# Altium schematic sheet Sheet2.SchDoc: Alarm_audio
size A; Date: 6/5/2021; Author: suren; DrawnBy: suren; DocumentNumber: 5; Time: 11.01PM
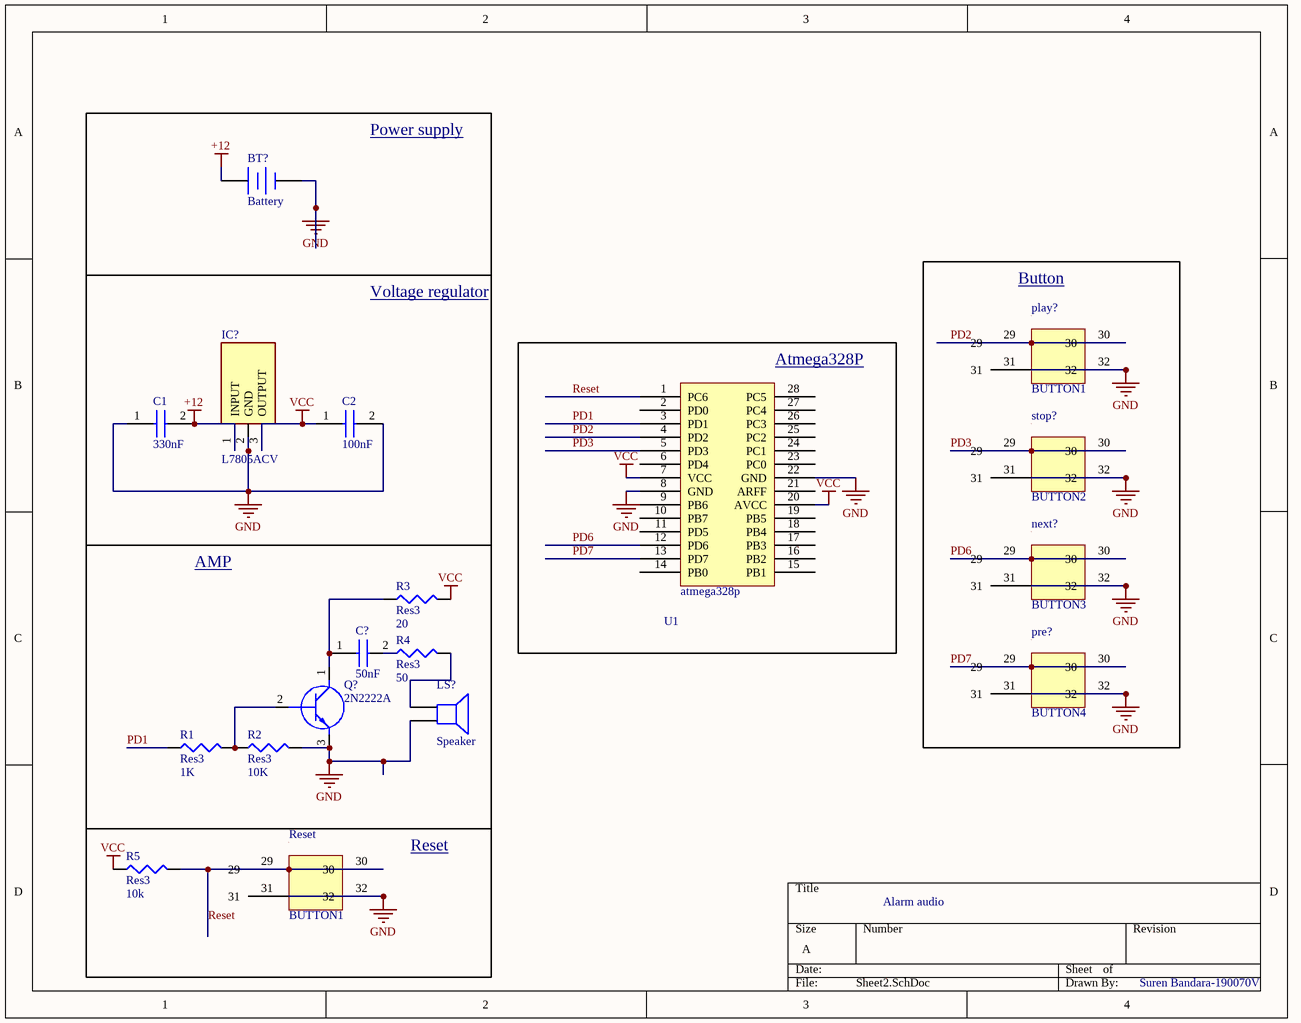
[diagram p0: Sheet2.SchDoc]

## Parts
BT?  Battery  [BAT-2]
C1  Capacitance: 330nF  [B32520C3104K000]  (hidden comment: B32520C3104K000)
C2  Capacirance: 100nF  [B32520C3104K000]  (hidden comment: B32520C3104K000)
C?  Capacirance: 50nF  [B32520C3104K000]  (hidden comment: B32520C3104K000)
IC?  L7805ACV  [TO255P460X1020X2008-3P]
LS?  Speaker  [PIN2]
next?  BUTTON3  [PCBComponent_6]
play?  BUTTON1  [PCBComponent_6]
pre?  BUTTON4  [PCBComponent_6]
Q?  2N2222A  [2N2222A]
R1  Res3  value 1K  [12Z-2010]
R2  Res3  value 10K  [12Z-2010]
R3  Res3  value 20  [12Z-2010]
R4  Res3  value 50  [12Z-2010]
R5  Res3  value 10k  [12Z-2010]
Reset  BUTTON1  [PCBComponent_6]
stop?  BUTTON2  [PCBComponent_6]
U?  atmega328p  Parameter 1: U1  [PCBComponent_1]

## Blocks framed on the sheet
Button: next? play? pre? stop?
Atmega328P: U?

## Nets
+12: BT?.1(+) C1.2 IC?.1(INPUT)
GND: BT?.2(-) C1.1 C2.2 IC?.2(GND) LS?.2 next?.31 next?.32 play?.31 play?.32 pre?.31 pre?.32 Q?.3(E) R2.2 Reset.31 Reset.32 stop?.31 stop?.32 U?.8(GND) U?.22(GND)
VCC: C2.1 IC?.3(OUTPUT) R3.2 R5.1 U?.7(VCC) U?.20(AVCC)
PD1: R1.1 U?.3(PD1)
PD2: play?.29 play?.30 U?.4(PD2)
PD3: stop?.29 stop?.30 U?.5(PD3)
PD6: next?.29 next?.30 U?.12(PD6)
PD7: pre?.29 pre?.30 U?.13(PD7)
Reset: R5.2 Reset.29 Reset.30 U?.1(PC6)
NetC?_1: C?.1 Q?.1(C) R3.1
NetC?_2: C?.2 R4.1
NetLS?_1: LS?.1 R4.2
NetQ?_2: Q?.2(B) R1.2 R2.1

Not connected (* = marked no-connect by the designer): U? 2(PD0) 6(PD4) 9(PB6) 10(PB7) 11(PD5) 14(PB0) 15(PB1) 16(PB2) 17(PB3) 18(PB4) 19(PB5) 21(ARFF) 23(PC0) 24(PC1) 25(PC2) 26(PC3) 27(PC4) 28(PC5)

## Notes on the sheet
- Power supply
- Voltage regulator
- AMP
- Reset
- Alarm audio
- Suren Bandara-190070V

## Library data of the parts
BT? = Battery: Multicell Battery; Published: 24-Mar-1999; LatestRevisionDate: 17-Jul-2002; LatestRevisionNote: Re-released for DXP Platform.; PackageReference: BAT-2; Publisher: Altium Limited; PackageDescription: Battery; 2 Leads
C1 C2 C? = B32520C3104K000: Capacitor; Manufacturer_Name: TDK; Datasheet Link: https://datasheet.datasheetarchive.com/originals/dk/DKDS41/DSANUWW0037983.pdf; Height: 8.5mm; Manufacturer_Part_Number: B32520C3104K000; Arrow Part Number: B32520C3104K000; Arrow Price/Stock: https://www.arrow.com/en/products/b32520c3104k000/epcos-tdk
IC? = L7805ACV: Integrated Circuit; Manufacturer_Name: STMicroelectronics; Datasheet Link: http://www.st.com/web/en/resource/technical/document/datasheet/CD00000444.pdf; Height: 4.6mm; Manufacturer_Part_Number: L7805ACV; Mouser Part Number: 511-L7805ACV; Mouser Price/Stock: https://www.mouser.co.uk/ProductDetail/STMicroelectronics/L7805ACV?qs=xv3lWMc77RdYd2PeLwOwYw%3D%3D; Arrow Part Number: L7805ACV; Arrow Price/Stock: https://www.arrow.com/en/products/l7805acv/stmicroelectronics
LS? = Speaker: Loudspeaker; Published: 24-Mar-1999; LatestRevisionDate: 17-Jul-2002; LatestRevisionNote: Re-released for DXP Platform.; PackageReference: PIN2; Publisher: Altium Limited
next? play? pre? Reset stop? = BUTTON
Q? = 2N2222A: Transistor BJT NPN; Manufacturer_Name: Foshan Blue Rocket Elec; Datasheet Link: https://datasheet.lcsc.com/szlcsc/1901291437_Foshan-Blue-Rocket-Elec-2N2222A_C358533.pdf; Height: 4.7mm; Manufacturer_Part_Number: 2N2222A
R1-R5 = Res3: Resistor; Published: 8-Jun-2000; LatestRevisionDate: 29-May-2009; LatestRevisionNote: IPC-7351 Footprint Added.; PackageReference: J1-0603; Publisher: Altium Limited; PackageDescription: Chip Resistor